# EAGLE board DIP09dat (EAGLE 5.00), part 1 of 2
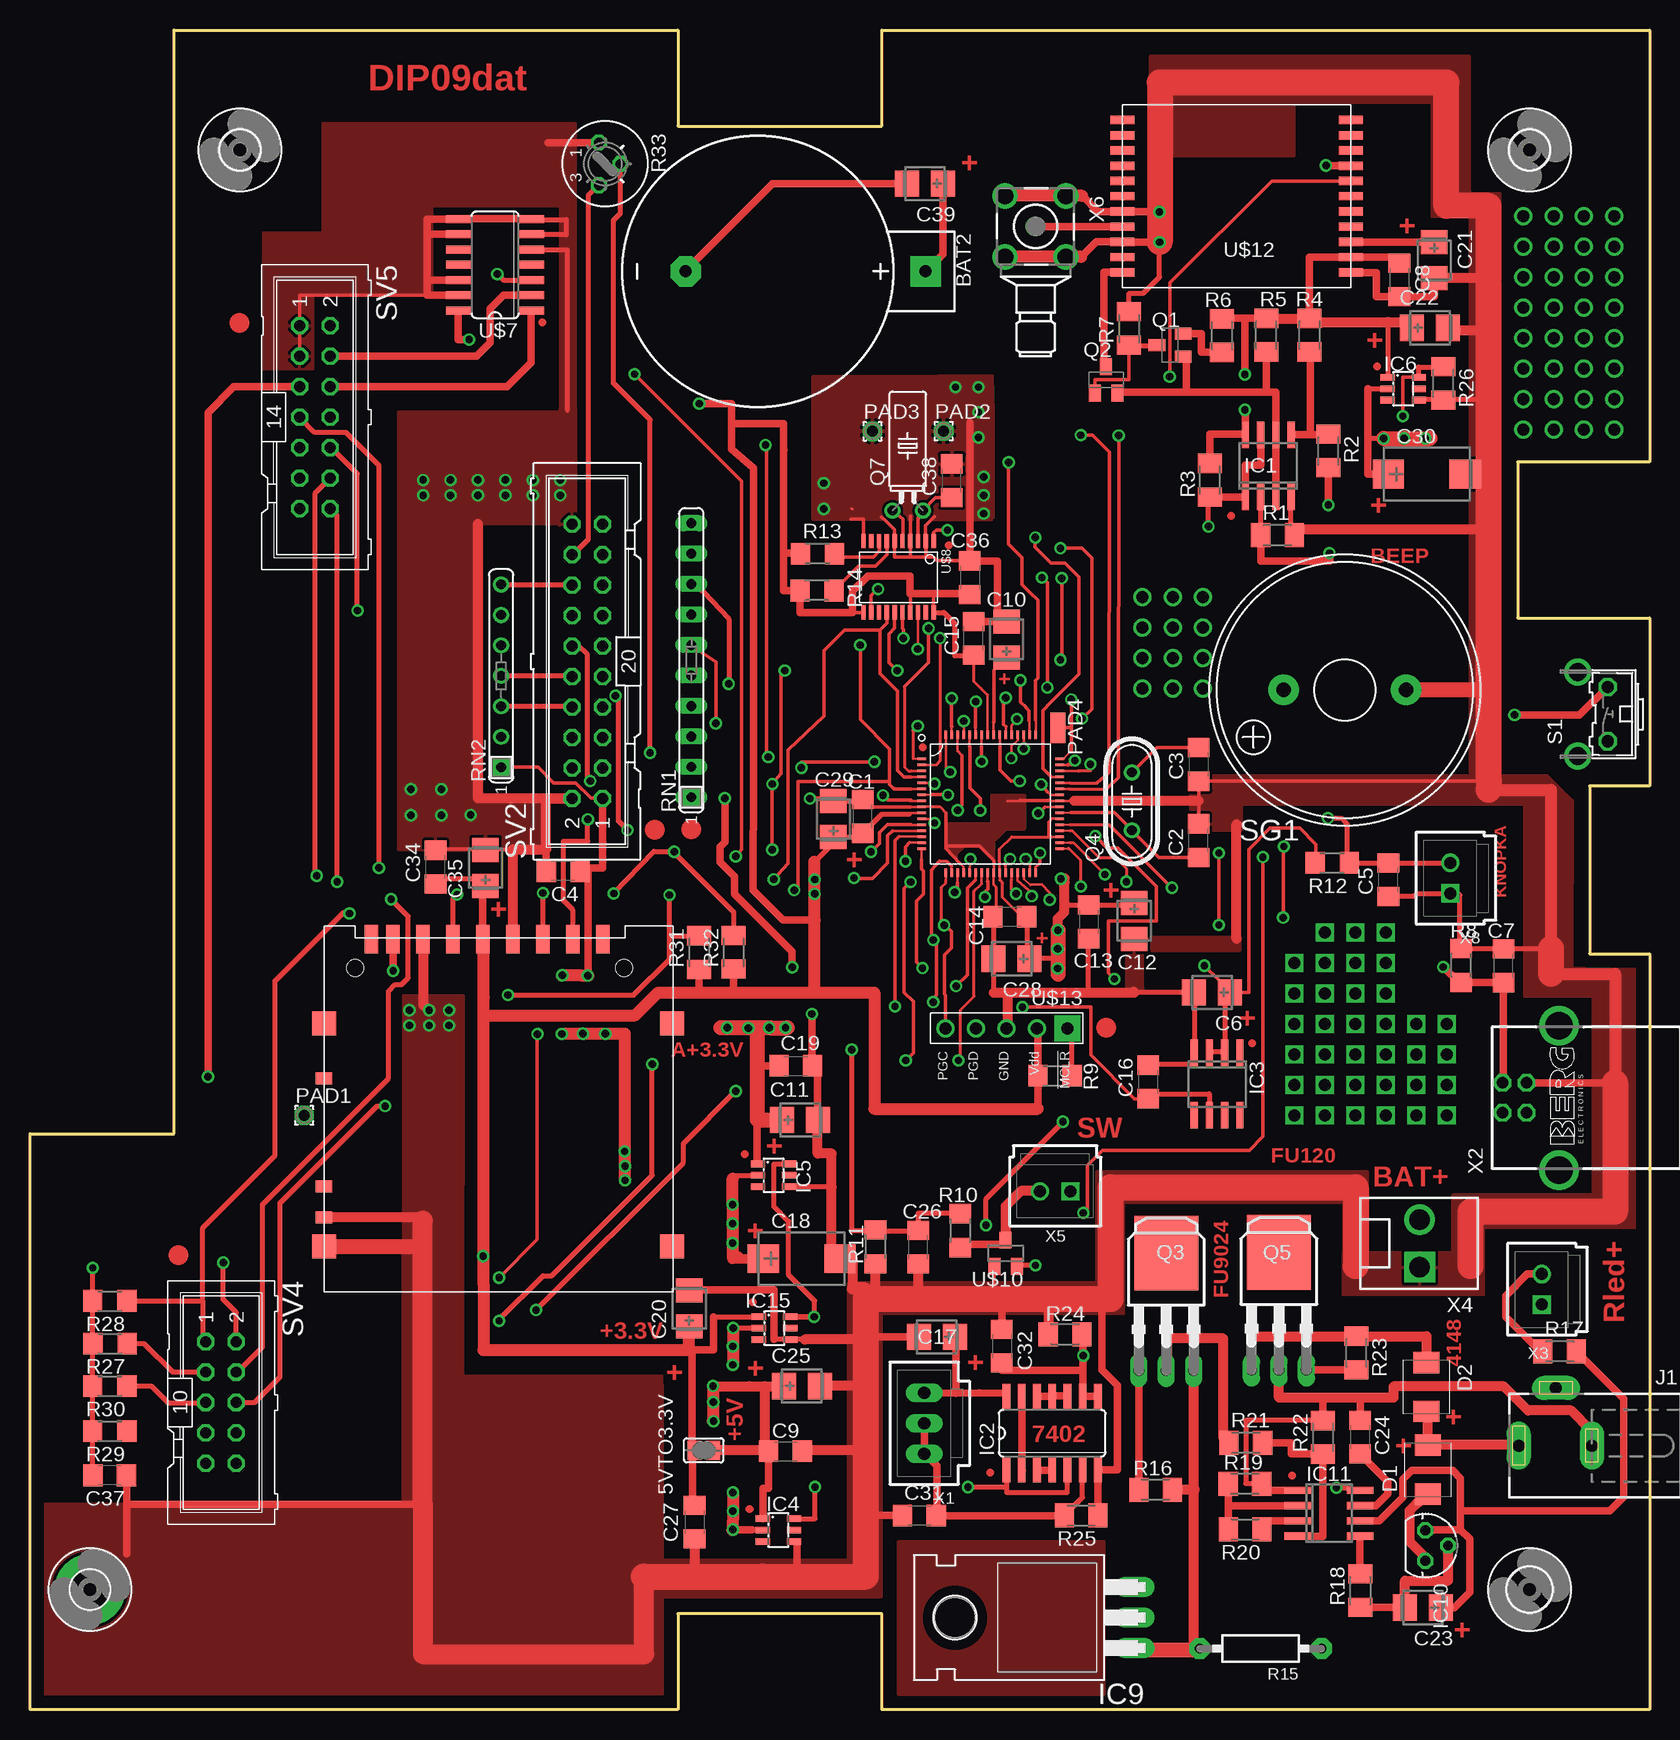
[diagram p2: board, top side]
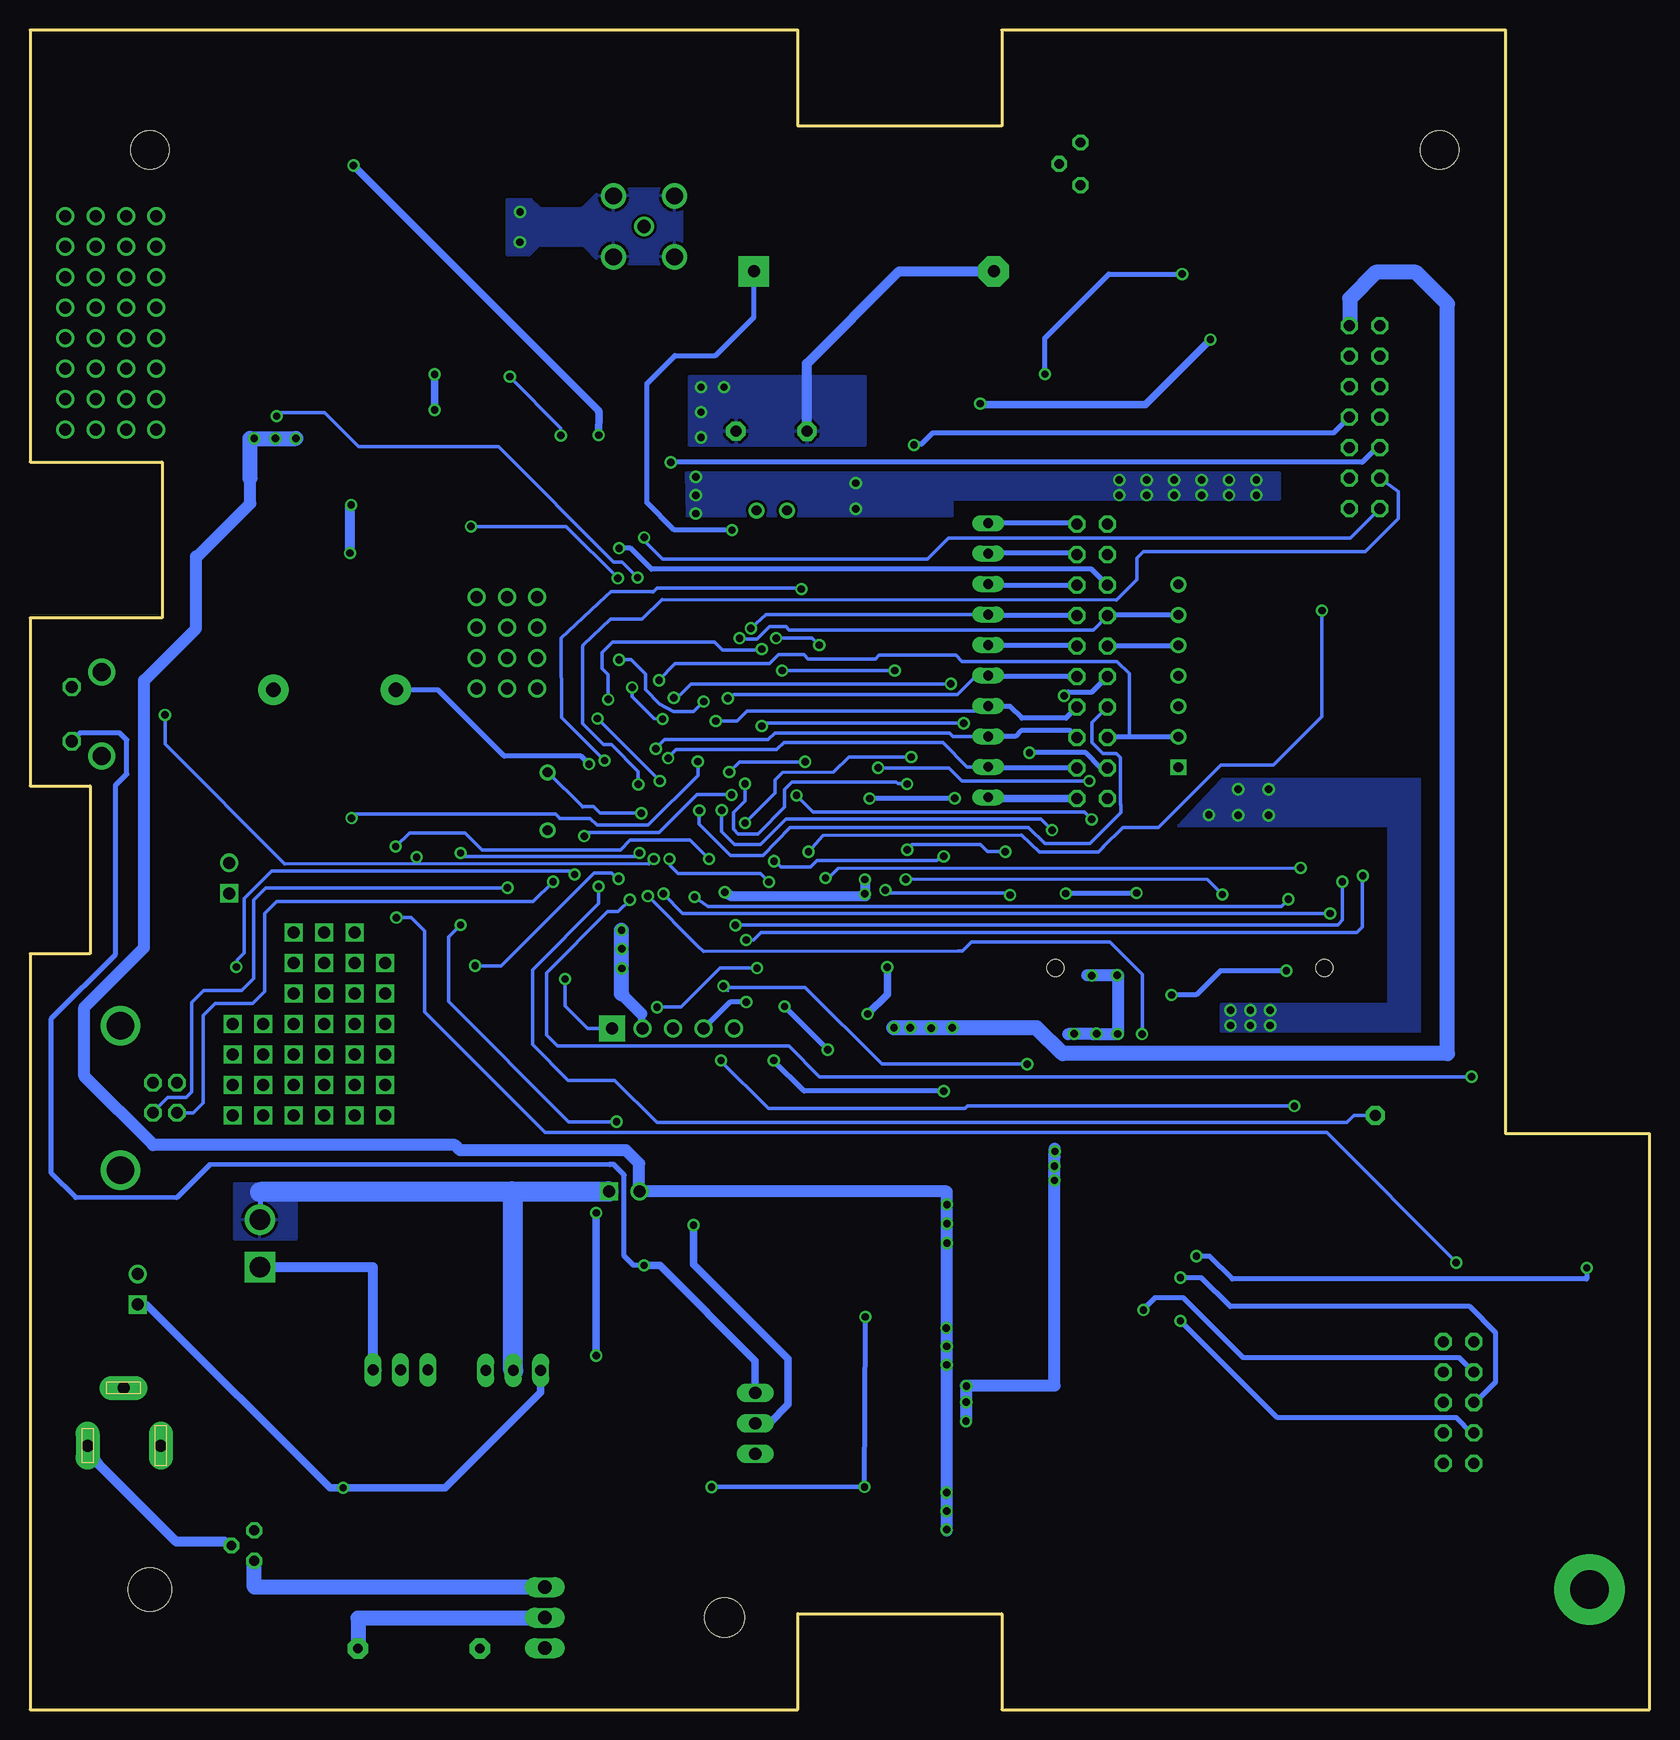
[diagram p3: board, bottom side, seen from below]

Size 135 x 140 mm. Coordinates in mm from the lower left corner, seen from the top.
Outline: 0,0 0,48 12,48 12,140 54,140 54,132 71,132 71,140 135,140 135,104 124,104 124,91 135,91 135,77 130,77 130,63 135,63 135,0 71,0 71,8 54,8 54,0 0,0
Copper layers (1*16): Top 0.035mm / dielectric 1.5mm / Bottom 0.035mm
Design rules "default *": minimum track width 8mil, minimum drill 24mil, track to track 8mil, track to pad 8mil, pad to pad 8mil, via to via 8mil, smd to smd 8mil, copper to edge 40mil, drill to drill 8mil, minimum pad ring 10mil, minimum via ring 8mil, stop-mask expansion 4mil, vias tented up to drill 24mil, thermal gap 10mil
Net classes: 1 power: width 0.813 mm; 2 net12: width 0.305 mm; 3 power25: width 0.635 mm; 4 power24: width 0.61 mm; 5 net16: width 0.406 mm; 6 net8: width 0.203 mm

## Footprints (pad centres in the part's own frame; a part is rotated, then mirrored left to right if it is on the bottom)
SJ = smd 1.168 x 1.6: 1 -0.762,0; 2 0.762,0
SN2032 = drill 1 pad 2.54 square: P$1 0,14 | drill 1 pad 2.54 octagon: P$2 0,-6
C1206 = smd 1.6 x 1.8: 1 -1.4,0; 2 1.4,0
CT3528 = smd 2 x 2.2: + -1.5,0; - 1.5,0
CT7343 = smd 2.6 x 2.4: + -3.2,0; - 3.2,0
SMBJ = smd 1.78 x 2.16: A 2.04,0; C -2.03,0
3,2-PAD = drill 3.2 pad 5.842 round: B3,2 0,0
3,2 = hole 3.2: 0,0
SO08 = smd 0.6 x 2.2: 1 -1.905,-2.6; 2 -0.635,-2.6; 3 0.635,-2.6; 4 1.905,-2.6; 5 1.905,2.6; 6 0.635,2.6; 7 -0.635,2.6; 8 -1.905,2.6
SO14 = smd 0.66 x 2.032: 1 -3.81,-3.073; 2 -2.54,-3.073; 3 -1.27,-3.073; 4 0,-3.073; 5 1.27,-3.073; 6 2.54,-3.073; 7 3.81,-3.073; 8 3.81,3.073; 9 2.54,3.073; 10 1.27,3.073; 11 0,3.073; 12 -1.27,3.073; 13 -2.54,3.073; 14 -3.81,3.073
SOT-23-6 = smd 0.55 x 1.2: 1 -0.95,-1.3; 2 0,-1.3; 3 0.95,-1.3; 4 0.95,1.3; 5 0,1.3; 6 -0.95,1.3
TO220H = drill 1.118 long: 1 -2.54,-10.16; 2 0,-10.16; 3 2.54,-10.16 | hole 3.302: 0,4.826
78LXX = drill 0.813 octagon: GND 0,1.905; IN 1.27,0; OUT -1.27,0
SOIC-8 = smd 0.6 x 2.2: 1 -1.905,-2.6; 2 -0.635,-2.6; 3 0.635,-2.6; 4 1.905,-2.6; 5 1.905,2.6; 6 0.635,2.6; 7 -0.635,2.6; 8 -1.905,2.6
DCJ0303 = drill 1 pad 2 long: 1 0,3.1; 2 4.8,0; 3 0,-3
1,6/0,9 = drill 0.914 pad 1.6 octagon: 1 0,0
SMD1,27-2,54 = smd 1.27 x 2.54: 1 0,0
SOT23-BEC = smd 1 x 1.4: B -0.95,-1.1; C 0,1.1; E 0.95,-1.1
I-PAK_TO251AA = drill 0.889 long: 1 -2.286,-5.334; 2 0,-5.334; 3 2.286,-5.334 | smd 5.334 x 6.223: 4 0,4.445
HC49/S = drill 0.813 round: 1 -2.413,0; 2 2.413,0
TC38H = drill 0.813 round: 1 -1.27,0; 2 1.27,0
M1206 = smd 1.6 x 2: 1 -1.4,0; 2 1.4,0
R1206 = smd 1.6 x 1.803: 1 -1.422,0; 2 1.422,0
0207/10B = drill 0.813 pad 1.676 octagon: 1 -5.08,0; 2 5.08,0
RJ6 = drill 0.813 octagon: A -1.778,-0.508; E 1.778,-0.508; S 0,1.27
SIL10 = drill 0.813 long: 1 -11.43,0; 2 -8.89,0; 3 -6.35,0; 4 -3.81,0; 5 -1.27,0; 6 1.27,0; 7 3.81,0; 8 6.35,0; 9 8.89,0; 10 11.43,0
SIL7 = drill 0.813 square: 1 -7.62,0 | drill 0.813 round: 2 -5.08,0; 3 -2.54,0; 4 0,0; 5 2.54,0; 6 5.08,0; 7 7.62,0
B3F-31XX = drill 1.016 octagon: 1 -2.261,-1.245; 2 2.261,-1.245 | drill 1.499 pad 2.159 round: 3 -3.505,1.245; 4 3.505,1.245
EB2209A = drill 1.2 pad 2.54 round: + 5.093,0; - -5.093,0
ML20 = drill 0.914 octagon: 1 -11.43,-1.27; 2 -11.43,1.27; 3 -8.89,-1.27; 4 -8.89,1.27; 5 -6.35,-1.27; 6 -6.35,1.27; 7 -3.81,-1.27; 8 -3.81,1.27; 9 -1.27,-1.27; 10 -1.27,1.27; 11 1.27,-1.27; 12 1.27,1.27; 13 3.81,-1.27; 14 3.81,1.27; 15 6.35,-1.27; 16 6.35,1.27; 17 8.89,-1.27; 18 8.89,1.27; 19 11.43,-1.27; 20 11.43,1.27
ML10 = drill 0.914 octagon: 1 -5.08,-1.27; 2 -5.08,1.27; 3 -2.54,-1.27; 4 -2.54,1.27; 5 0,-1.27; 6 0,1.27; 7 2.54,-1.27; 8 2.54,1.27; 9 5.08,-1.27; 10 5.08,1.27
ML14 = drill 0.914 octagon: 1 -7.62,-1.27; 2 -7.62,1.27; 3 -5.08,-1.27; 4 -5.08,1.27; 5 -2.54,-1.27; 6 -2.54,1.27; 7 0,-1.27; 8 0,1.27; 9 2.54,-1.27; 10 2.54,1.27; 11 5.08,-1.27; 12 5.08,1.27; 13 7.62,-1.27; 14 7.62,1.27
3,6 = hole 3.6: 0,0
TQFP-64-PT-0.5MM = smd 0.7 x 0.22: 1 -5.75,3.75; 2 -5.75,3.25; 3 -5.75,2.75; 4 -5.75,2.25; 5 -5.75,1.75; 6 -5.75,1.25; 7 -5.75,0.75; 8 -5.75,0.25; 9 -5.75,-0.25; 10 -5.75,-0.75; 11 -5.75,-1.25; 12 -5.75,-1.75; 13 -5.75,-2.25; 14 -5.75,-2.75; 15 -5.75,-3.25; 16 -5.75,-3.75; 33 5.75,-3.75; 34 5.75,-3.25; 35 5.75,-2.75; 36 5.75,-2.25; 37 5.75,-1.75; 38 5.75,-1.25; 39 5.75,-0.75; 40 5.75,-0.25; 41 5.75,0.25; 42 5.75,0.75; 43 5.75,1.25; 44 5.75,1.75; 45 5.75,2.25; 46 5.75,2.75; 47 5.75,3.25; 48 5.75,3.75 | smd 0.22 x 0.7: 17 -3.75,-5.75; 18 -3.25,-5.75; 19 -2.75,-5.75; 20 -2.25,-5.75; 21 -1.75,-5.75; 22 -1.25,-5.75; 23 -0.75,-5.75; 24 -0.25,-5.75; 25 0.25,-5.75; 26 0.75,-5.75; 27 1.25,-5.75; 28 1.75,-5.75; 29 2.25,-5.75; 30 2.75,-5.75; 31 3.25,-5.75; 32 3.75,-5.75; 49 3.75,5.75; 50 3.25,5.75; 51 2.75,5.75; 52 2.25,5.75; 53 1.75,5.75; 54 1.25,5.75; 55 0.75,5.75; 56 0.25,5.75; 57 -0.25,5.75; 58 -0.75,5.75; 59 -1.25,5.75; 60 -1.75,5.75; 61 -2.25,5.75; 62 -2.75,5.75; 63 -3.25,5.75; 64 -3.75,5.75
TSSOP_20 = smd 0.36 x 1.19: 1 0,0; 2 0.65,0; 3 1.3,0; 4 1.95,0; 5 2.6,0; 6 3.25,0; 7 3.9,0; 8 4.55,0; 9 5.2,0; 10 5.85,0; 11 5.85,5.94; 12 5.2,5.94; 13 4.55,5.94; 14 3.9,5.94; 15 3.25,5.94; 16 2.6,5.94; 17 1.95,5.94; 18 1.3,5.94; 19 0.65,5.94; 20 0,5.94
SOT-23 = smd 1 x 1.4: 1 -0.95,-1.1; 2 0.95,-1.1; 3 0,1.1
DM1A = smd 1.1 x 2.4: 1 18.15,2.4; 2 15.65,2.4; 3 13.15,2.4; 4 10.65,2.4; 5 8.15,2.4; 6 5.65,2.4; 7 3.15,2.4; 8 1.35,2.4; 9 20.65,2.4 | smd 1.4 x 1: P14CD -2.6,-9.2; P15WP -2.6,-18.2; P16COM -2.6,-20.8 | smd 2 x 2: P$10 26.4,-4.6; P$11 26.4,-23.2; P$12 -2.6,-4.6; P$13 -2.6,-23.2 | hole 1.4: 0,0; 22.4,0
A1080 = smd 2 x 0.7: 1 0,0; 2 0,-1.27; 3 0,-2.54; 4 0,-3.81; 5 0,-5.08; 6 0,-6.35; 7 0,-7.62; 8 0,-8.89; 9 0,-10.16; 10 0,-11.43; 11 0,-12.7; 12 19.05,-12.7; 13 19.05,-11.43; 14 19.05,-10.16; 15 19.05,-8.89; 16 19.05,-7.62; 17 19.05,-6.35; 18 19.05,-5.08; 19 19.05,-3.81; 20 19.05,-2.54; 21 19.05,-1.27; 22 19.05,0
PIC-PROG-CON = drill 1 pad 2.184 square: 1 -3.81,0 | drill 1 round: 2 -1.27,0; 3 1.27,0; 4 3.81,0; 5 6.35,0
70543-03 = drill 1.016 long: 1 -2.54,0; 2 0,0; 3 2.54,0
PN61729-S = drill 0.95 octagon: 1 1.25,4.71; 2 -1.25,4.71; 3 -1.25,2.71; 4 1.25,2.71 | drill 2.3 pad 2.9 round: S1 -6.02,0; S2 6.02,0
70543-02 = drill 1.016 square: 1 -1.27,0 | drill 1.016 round: 2 1.27,0
KK-156-2 = drill 1.7 pad 2.184 square: 1 -1.98,0 | drill 1.7 pad 2.184 round: 2 1.98,0
BU-SMB-H = drill 1.1 round: 1 0,0 | drill 1.4 round: 2 -2.54,2.54; 3 2.54,2.54; 4 2.54,-2.54; 5 -2.54,-2.54

## Placement (x,y rotation side)
5VTO3.3V  5VTO3.3V  [SJ]  56.16,21.61 0 top
BAT2  VCLOCK  [SN2032]  60.66,119.88 270 top
C1  0.47uF  [C1206]  69.42,74.45 90 top
C2  15pF  [C1206]  97.4,72.43 90 top
C3  15pF  [C1206]  97.43,78.78 90 top
C4  1uF  [C1206]  44.45,69.89 180 top
C5  1uF  [C1206]  113.23,69.17 90 top
C6  10u  [CT3528]  98.53,59.77 180 top
C7  2uF  [C1206]  122.83,61.98 90 top
C8  0.47u  [C1206]  114.14,119.17 270 top
C9  0.47u  [C1206]  62.97,21.53 0 top
C10  10u  [CT3528]  81.41,89.2 90 top
C11  10u  [CT3528]  64.2,49.15 0 top
C12  10u  [CT3528]  92.05,65.75 270 top
C13  0.47uF  [C1206]  88.25,65.65 270 top
C14  0.47uF  [C1206]  81.68,66.07 180 top
C15  0.47uF  [C1206]  78.65,89.29 90 top
C16  1.0u  [C1206]  93.22,52.31 90 top
C17  10u  [CT3528]  75.59,31.06 180 top
C18  100u  [CT7343]  64.32,37.59 0 top
C19  0.47u  [C1206]  63.83,53.66 0 top
C20  10u  [CT3528]  54.95,33.42 90 top
C21  47u  [CT3528]  117.06,120.82 270 top
C22  47u  [CT3528]  116.7,115.17 0 top
C23  47u  [CT3528]  116.1,8.5 180 top
C24  2n2  [C1206]  110.86,22.71 270 top
C25  47u  [CT3528]  64.34,26.97 0 top
C26  0.47uF  [C1206]  74.04,38.54 90 top
C27  0.47u  [C1206]  55.39,15.62 270 top
C28  10u  [CT3528]  81.83,62.58 180 top
C29  10u  [CT3528]  66.97,74.23 90 top
C30  100u  [CT7343]  116.43,102.98 0 top
C31  1u  [C1206]  74.14,16.18 0 top
C32  1u  [C1206]  81.01,30.29 270 top
C34  0.47u  [C1206]  33.81,70.22 90 top
C35  10u  [CT3528]  37.97,70.15 90 top
C36  0.47uF  [C1206]  78.34,94.35 270 top
C37  0.47uF  [C1206]  6.65,19.52 180 top
C38  15p  [C1206]  76.83,102.43 90 top
C39  10u  [CT3528]  74.61,127.19 180 top
D1  15MQ040  [SMBJ]  116.51,19.99 90 top
D2  1N4148  [SMBJ]  116.4,26.9 270 top
H1  MOUNT-PAD-ROUND3.2  [3,2-PAD]  5,10 0 top
H2  MOUNT-HOLE3.2  [3,2]  125,130 0 top
H3  MOUNT-HOLE3.2  [3,2]  17.5,130 0 top
IC1  MCP6547  [SO08]  103.22,103.67 0 top
IC2  74AC02D  [SO14]  85.21,23.04 0 top
IC3  REF191  [SO08]  98.95,52.14 180 top
IC4  ADP3330_5  [SOT-23-6]  62.39,14.96 270 top
IC5  ADP3330_3  [SOT-23-6]  61.99,44.53 270 top
IC6  ADP3330  [SOT-23-6]  114.47,110.09 270 top
IC9  317T  [TO220H]  81.94,7.66 90 top
IC10  78L09  [78LXX]  116.3,13.66 270 top
IC11  TEA1104  [SOIC-8]  108.28,16.36 270 top
IC15  ADP3330_3  [SOT-23-6]  62.06,31.79 270 top
J1  DJK-02A  [DCJ0303]  127.2,22 90 top
PAD1  p_pad  [1,6/0,9]  22.86,49.53 0 top
PAD2  GND  [1,6/0,9]  76.16,106.56 0 top
PAD3  GND  [1,6/0,9]  70.22,106.55 0 top
PAD4  32768  [SMD1,27-2,54]  85.68,81.85 180 top
Q1  BC858ASMD  [SOT23-BEC]  95.03,113.72 90 top
Q2  BC858ASMD  [SOT23-BEC]  89.7,110.83 0 top
Q3  IRFU9024  [I-PAK_TO251AA]  94.72,33.6 0 top
Q4  20MHz  [HC49/S]  91.85,75.7 90 top
Q5  IRFU120  [I-PAK_TO251AA]  104.11,33.65 0 top
Q7  32768  [TC38H]  73.17,99.95 0 top
R1  63.4k  [M1206]  103.98,97.88 0 top
R2  2.2k  [M1206]  108.23,104.91 270 top
R3  100k  [M1206]  98.34,102.47 270 top
R4  2.2k  [M1206]  106.67,114.57 270 top
R5  10E  [M1206]  103.04,114.56 270 top
R6  100E  [M1206]  99.37,114.52 270 top
R7  10k  [M1206]  91.61,115.12 90 top
R8  150K  [R1206]  119.3,62.02 270 top
R9  10K  [R1206]  85.45,52.82 180 top
R10  1M1  [R1206]  77.54,39.92 90 top
R11  470K  [R1206]  70.48,38.56 270 top
R12  10K  [R1206]  108.55,70.58 180 top
R13  10K  [R1206]  65.65,96.34 0 top
R14  10K  [R1206]  65.61,93.27 0 top
R15  5.1E  [0207/10B]  102.58,5.08 180 top
R16  10k  [M1206]  93.83,18.33 0 top
R17  5.1k  [M1206]  127.51,29.84 0 top
R18  27k  [M1206]  110.88,9.91 90 top
R19  5.1k  [M1206]  101.27,18.82 0 top
R20  13k  [M1206]  101.29,15.02 180 top
R21  10k  [M1206]  101.35,22.23 0 top
R22  4.3k  [M1206]  107.78,22.69 90 top
R23  10k  [M1206]  110.57,29.72 270 top
R24  1k  [M1206]  86.28,31.29 180 top
R25  1k  [M1206]  87.63,16.17 180 top
R26  10k  [M1206]  117.81,110.54 270 top
R27  10K  [R1206]  6.67,30.52 180 top
R28  10K  [R1206]  6.66,34.06 180 top
R29  10K  [R1206]  6.66,23.21 180 top
R30  10K  [R1206]  6.66,26.96 180 top
R31  10k  [M1206]  55.78,63.09 90 top
R32  10k  [M1206]  58.66,63.12 90 top
R33  10k  [RJ6]  47.94,128.84 270 top
RN1  10k  [SIL10]  55.13,87.46 90 top
RN2  10k  [SIL7]  39.27,86.16 90 top
S1  SWT-7  [B3F-31XX]  130.27,82.98 90 top
SG1  EB2209A  [EB2209A]  109.6,84.99 180 top
SV2  T6963 DYSPLAY  [ML20]  46.44,87.38 90 top
SV4  KLAVA  [ML10]  15.93,25.59 270 top
SV5  TO_ANALOG  [ML14]  23.75,107.72 270 top
U$5  [3,6]  125,10 0 top
U$6  PIC24FJZZZGB106  [TQFP-64-PT-0.5MM]  80.08,75.5 0 top
U$7  HEF4070B  [SO14]  38.77,120.42 90 top
U$8  DS1306_TSSOP_PAK  [TSSOP_20]  75.33,97.39 180 top
U$10  MCP1702  [SOT-23]  81.33,38.03 0 top
U$11  HRS_DM1A  [DM1A]  27.11,61.8 0 top
U$12  TYCO_A1080  [A1080]  110.12,119.79 180 top
U$13  PIC-PROG-CON  [PIC-PROG-CON]  82.67,56.78 180 top
X1  C-GRID-03-70543  [70543-03]  74.54,23.86 90 top
X2  PN61729-S  [PN61729-S]  127.47,50.98 90 top
X3  C-GRID-02-70543  [70543-02]  126.02,35.03 90 top
X4  ACCUM  [KK-156-2]  115.85,38.85 90 top
X5  C-GRID-02-70543  [70543-02]  85.46,43.18 180 top
X6  GPS  [BU-SMB-H]  83.82,123.63 270 top
X8  C-GRID-02-70543  [70543-02]  118.39,69.3 90 top

## Tracks (layer width: path | path; a pad name or v marks a point on that pad's centre or on a via)
32KHZ  (via drill 0.61)
  Top 0.203: 86.8,80 86.15,79.25 U$6.48 | v74,88.4 74,90.9 U$8.18
  Top 0.305: v86.8,84.2 86.8,81.86 | 86.8,81.86 86.8,80 | 86.8,81.86 86.78,81.86 86.78,81.85 PAD4.1
  Bottom 0.305: v86.8,84.2 86.8,86.26 87.3,86.76 87.3,88.11 86.42,88.99 77.93,88.99 77.27,88.33 74.04,88.33 73.98,88.39 73.99,88.4 v74,88.4
+3V3  (via drill 0.61)
  Top 0.203: v37.76,37.79 37.8,35.5 | 79.3,85.1 79.83,84.6 79.83,84.57 79.83,81.5 U$6.57 | 98.6,54.8 IC3.3 | 99.3,54.8 IC3.2 99.6,55.8 | C6.+ 99.6,58.7 | 84.93,74 85.18,74.25 85.51,74.25 U$6.38 | 85.14,72.74 U$6.35 | 77.33,68.93 U$6.19 | 86.27,67.07 86.21,67.18 86.1,67.4 | 80.84,69.16 U$6.26 80.83,70.64 | v65.41,69.19 65.41,68 v65.4,68 v65.41,67.99 | 65.41,65.8 65,65.8 | U$6.10 74,74.75 73.3,74.74 73.31,74.64 | v85.67,61.77 85.7,61.8 85.69,61.8 | v85.67,63.41 85.7,63.4 85.69,63.4 | R9.2 84.1,52.9 84.02,52.9
  Top 0.254: 84.93,72.74 85.14,72.74 | 84.93,72.74 84.93,74 | 80.83,70.64 80.83,71.74 81.84,72.74 84.93,72.74 | 80.84,69.16 80.84,69.12 81.08,68.89 81.08,67.68 82.37,66.39 82.7,66.39 83.02,66.07 C14.1 | 79.83,84.57 79.81,84.57 78.65,85.73 78.65,87.85
  Top 0.305: v97.9,62 99.1,60.8 C6.+ 100.02,59.75 | U$8.17 73.38,93.1 73.36,93.1 | U$8.20 75.33,93.03 75.34,93.03 | 100.02,59.75 99.82,59.75 | 100.02,59.75 101.61,59.75 101.61,71.7 103.37,73.46 105.84,73.46 107.2,72.1 107.2,70.5 R12.2 | 77.33,68.93 | 77.33,68.93 77.33,68.95 | v77.08,68.12 77.33,68.37 77.33,68.93 | U$8.11 68.59,91.45 68.58,91.44
  Top 0.406: IC15.1 56.96,32.73 | 83.13,62.58 83.13,66.07 | C13.1 91.94,67.05 | C29.+ 69.03,72.73 | 99.3,54.8 98.6,54.8 | 99.6,58.7 99.6,55.8 | 37.97,69.23 33.81,69.23 | 36.63,114.19 36.6,114.19 v36.6,114.2 | 58.47,107.19 61.01,107.14 | C37.2 5.25,23.16 5.23,23.18 5.24,23.2 R29.2 R30.2 | R30.2 5.24,26.98 5.23,26.99 | R30.2 5.24,30.3 5.27,30.33 5.25,30.36 R27.2 5.25,33.89 5.27,33.91 5.24,33.94 R28.2 v5.23,36.81 v5.24,36.81 | C1.1 71.02,74.64 73.31,74.64 | 86.23,67.2 86.22,67.2 86.21,67.18 | 86.23,68.94 v85.93,69.25 | 85.71,62.6 83.33,62.6 | 86.28,67.06 C13.1 | U$8.20 76.17,91.45 77.07,90.55 77.07,87.85 78.65,87.85 | 78.65,87.85 78.68,87.85 | 78.65,87.85 C15.1 | 65.39,70.65 66.97,72.23
  Top 0.61: 56.96,32.73 56.96,29.97 55.24,29.97 | 55.23,21.61 55.23,17.02 | 65,65.8 62.78,65.8 60.28,68.3 60.32,78.25 60.33,78.85 60.33,103.47 58.47,105.05 58.47,107.19 | 58.47,107.19 58.47,108.85 v55.79,108.85 | 58.47,107.19 62.8,107.19 62.8,104.92 | C36.2 78.34,93.03 75.34,93.03 73.36,93.03 73.36,93.1 73.36,94.47 73.34,94.36 73.28,94.49 69.85,94.49 68.58,93.22 68.58,91.44 64.19,91.44 R14.1 62.8,93.27 62.8,96.39 | 37.74,68.65 37.74,68.68 | 37.74,68.65 C35.+ 37.97,69.23 | 37.8,64.26 37.74,64.26 37.74,68.65 | 33.8,69.23 33.81,69.23 C34.1 | U$7.14 35.7,114.19 36.6,114.19 | 84.02,50.08 84.02,52.9 84.02,56.73 | 62.8,104.92 62.8,96.39 | 62.8,104.92 62.86,104.98 | 54.93,29.97 54.99,29.97 | 54.99,29.97 55.24,29.97 | 54.99,29.97 54.99,29.96 | 55.24,29.97 55.19,29.97 55.19,21.61 | R13.1 64.18,96.39 62.8,96.39 | 58.69,59.76 58.69,59.8 58.66,59.83 R32.1 | 55.82,59.76 55.82,59.82 55.78,59.85 R31.1
  Top 0.813: 55.19,21.61 5VTO3.3V.1 55.23,21.61 | 55.23,17.02 C27.1 | 83.13,66.09 83.13,66.07 C14.1 | C28.+ 83.13,62.58 | 88.18,67.07 88.2,67.05 C13.1 | C12.+ 92.05,67.24 92.09,67.2 91.94,67.05 | C1.1 69.37,73.05 69.36,73.06 69.03,72.73 | 86.23,67.2 86.23,68.94 86.23,69.28 85.91,69.28 | 86.28,67.06 86.27,67.07 86.21,67.02 86.21,66.47 85.68,65.93 85.68,64.95 v85.69,64.97
  Top 1.016: 37.8,57.86 37.8,35.5 37.8,29.97 54.93,29.97 54.93,31.92 C20.+ | 37.8,57.86 37.8,59.38 | 37.8,59.38 37.8,59.77 37.8,64.2 | 65.41,68 65.41,65.8 65.41,59.99 65.3,59.99 65.49,59.81 | 37.8,64.2 37.8,64.26 | 37.8,64.2 U$11.4 | 65.49,59.81 65.54,59.76 | 84.02,56.71 83.96,56.78 U$13.2 83.94,56.73 84.02,56.73 | 37.8,59.38 37.83,59.38 | 65.55,59.77 | 65.54,59.76 65.55,59.77 | 65.54,59.76 70.38,59.76 70.38,50.08 84.02,50.08 | 65.49,59.81 65.51,59.83 | 65.49,59.81 | 65.49,59.81 65.44,59.76 58.69,59.76 55.82,59.76 52.36,59.76 50.46,57.86 37.8,57.86 | 66.97,72.23 C29.+ | 65.41,67.92 65.42,67.91 | v65.41,67.99 65.41,67.92 | 65.39,70.65 65.39,67.93 65.41,67.92
  Top 1.27: v85.69,64.97 85.69,63.4 85.69,61.8 85.69,61.3 85.71,61.3 85.71,62.6 | 83.33,62.6 C28.+
  Bottom 0.203: U$13.2 83.9,56.8 84.02,56.8
  Bottom 0.305: v97.9,62 95.71,62 87.97,69.74 86.51,69.74 86.01,69.25 v85.93,69.25
  Bottom 0.406: 55.77,108.78 55.77,108.84 v55.79,108.85 | v37.77,37.79 37.78,37.79 | v37.77,37.79 v37.76,37.79 | v37.77,37.79 36.68,37.79 34.77,35.88 5.23,35.88 v5.23,36.81 v5.24,36.81 | 76.64,67.87 76.66,67.89 76.69,67.89 | v85.93,69.25 85.95,69.26
  Bottom 0.61: v36.6,114.2 42.02,108.78 55.77,108.78 | 84.02,57.99 84.02,56.8 84.02,56.71
  Bottom 0.813: 76.64,67.87 76.55,67.78 65.34,67.78 65.38,67.82 65.38,69.21 | 65.38,69.21 65.38,69.27 | v65.41,69.19 65.38,69.21 | 77.09,68.14 | 77.09,68.14 v77.08,68.12 | 76.69,67.89 76.94,68.14 77.09,68.14
  Bottom 1.016: 84.02,57.99 85.69,59.65
  Bottom 1.27: 85.69,59.65 v85.69,64.97
+5V  (via drill 0.61)
  Top 0.203: v44.38,61.2 44.4,61.2 44.32,61.2 | 46,61.18 46,61.2 v46.49,61.17 | 44.33,56.33 44.4,56.4 44.27,56.32 | v46.1,56.33 46.1,56.4 46.1,56.32 | v47.96,56.32 48,56.4 48,56.32 | v44.34,56.31 44.4,56.3 44.4,56.32 | 46.53,69.3 46.6,69.3 C4.1
  Top 0.305: RN2.1 42.34,78.54 43.64,77.24 45.48,77.24 46.76,75.97 47.68,75.97 SV2.1
  Top 0.406: C25.+ 62.81,26.97 62.8,26.96
  Top 0.61: 46.53,61.18 46.53,69.3 46.53,70.04 | IC4.1 61.09,18.45 61.58,18.45 61.58,21.44 61.57,21.44 | 61.57,21.44 61.54,21.44 | C9.1 61.57,21.44 | C4.1 45.82,70.14 47.71,70.14 SV2.1 | 59.96,26.96 59.96,26.94
  Top 0.813: 61.59,21.61 61.59,21.53 C9.1 | 61.24,21.62 5VTO3.3V.2 | 61.24,21.62 61.59,21.61 | 61.59,21.61 61.59,21.71 | 56.93,26.96 59.96,26.96 62.8,26.96 | 61.24,21.62 61.24,26.95 59.96,26.94
  Top 1.016: 56.93,26.96 v56.93,26.97 56.93,24.08 56.98,24.08 v56.98,24.03 | v49.6,44.1 v49.6,45.29 49.6,56.32 48,56.32 46.1,56.32 44.4,56.32 44.27,56.32 | 46.53,61.18 46,61.18 44.32,61.18 44.32,61.2 44.32,61.21
  Bottom 0.203: v46.49,61.17 46.5,61.2 46.5,61.21 | 46.4,56.31 46.4,56.3 v46.1,56.33 | v44.34,56.31 44.7,56.3 44.27,56.32 | 49.6,46.1 v49.56,46.52
  Bottom 0.61: 55.17,76.03 55.17,76.04 | 55.17,76.03 RN1.1 | SV2.1 55.17,75.95 55.17,76.03
  Bottom 1.016: v56.98,24.03 56.98,24.05 56.96,24.05 v56.96,25.63 | v56.93,26.97 56.93,25.62 56.98,25.62 56.98,26.98 49.6,26.98 v49.6,44.1 | v49.6,44.1 | v49.6,44.1 49.6,46.1 | 49.6,46.1 | 49.6,46.1 49.6,46.74 | 44.3,56.31 46.4,56.31 48.45,56.31 | 44.27,56.32 44.27,61.21 46.5,61.21 46.86,61.21
+7V  (via drill 0.61)
  Top 0.203: 60.2,31.8 IC15.2 | v58.56,38.88 58.6,38.9 58.58,38.9 | 58.58,41 58.6,41 v58.56,40.5 | v58.56,42.09 58.6,42.1 58.58,42.1 | v58.59,16.55 58.6,16.6 | 58.59,31.8 58.7,31.8 | v58.58,30.26 58.6,30.3 58.59,30.3 | v114.55,105.97 114.6,106 114.6,105.95 | 59,37.7 58.58,37.71 58.6,37.6 58.55,37.6
  Top 0.406: 60.2,14.97 IC4.2 | IC5.2 58.58,44.53 58.58,44.26 | 58.59,28.7 v58.59,28.73 v58.58,28.73 | 58.59,31.8 v58.61,31.8 58.7,31.8 60.2,31.8 | v58.6,18.1 v58.6,18.09 v58.59,18.09 | v112.85,105.95 111.46,105.95 111.46,106.05 | 111.46,106.05 111.46,110.08 111.53,110.08 IC6.2 | IC6.2 | IC6.2 113.16,110.06 | 111.46,106.05 111.47,106.05 111.47,102.87
  Top 0.61: 58.55,14.97 60.2,14.97 | U$10.3 81.33,38.79 77.83,38.79 R10.1 | 111.53,110.09 111.53,110.08 111.53,102.98 C30.+
  Top 0.813: 84.19,43.21 84.21,43.21 | X5.2 84.19,43.21 | 84.19,43.21 82.6,43.21 81.33,41.94 U$10.3 81.33,39.12 81.34,39.12 | C18.+ 58.55,37.56 58.55,37.6 58.55,37.67
  Top 1.016: 58.58,37.71 58.58,38.9 58.58,41 58.58,42.1 58.58,44.26 | v58.59,28.73 58.59,30.3 58.59,31.8 | 58.55,14.97 58.6,16.6 v58.6,18.09 | 59,37.7 58.6,37.7
  Top 1.27: v112.85,105.95 114.6,105.95 116.67,105.95 116.7,105.97
  Bottom 0.203: v58.59,15 v58.58,14.99 | 58.58,31.8 v58.61,31.8 | X5.2 84.6,44.6 | v58.59,18.09 v58.6,18.1 v58.58,18.1 | v58.56,42.09 58.6,42.1 58.58,42.1 | 116.66,105.5 116.5,105.5 v116.31,105.97
  Bottom 1.016: 58.58,14.92 v58.58,14.99 v58.58,18.1 58.58,31.8 58.58,42.1 58.58,43.18 X5.2 84.16,43.18 84.07,43.27 84.22,43.43 84.22,45.52 85.33,46.62 99.13,46.62 99.57,47.06 124.75,47.06 130.47,52.79 130.47,52.8 130.47,58.52 125.48,63.51 125.48,85.78 121.15,90.11 121.15,96.13 121.14,96.14 121.03,96.14 116.64,100.53 116.64,102.62 116.67,102.66 116.66,102.66
  Bottom 1.27: v112.85,105.95 116.66,105.95 116.66,105.5 116.66,102.66 116.66,102.62
ADC_0  (via drill 0.61)
  Top 0.203: 83.4,68.75 82.84,69.25 82.84,69.4 U$6.30
  Top 0.254: v85,67.5 85,68.06 84.36,68.75 83.4,68.75
  Top 0.305: 22.52,110.28 22.5,110.26 SV5.5
  Top 0.61: v14.83,52.74 14.83,108.12 16.99,110.28 22.52,110.28
  Bottom 0.305: v85,67.5 85.99,66.51 86.84,66.51 91.94,61.41 91.94,56.22 91.01,55.3 71.74,55.3 69.18,52.74 v14.83,52.74 | 22.53,110.24 22.5,110.24 SV5.5
ADC_1  (via drill 0.61)
  Top 0.203: 71.93,73.24 74,73.25 U$6.13
  Top 0.305: 71.93,73.24 71.89,73.24 71.48,72.83 71.48,70.56 70.22,69.29 68.67,69.29 | 68.67,69.29 68.66,69.29 | v68.69,69.31 68.67,69.29
  Top 0.406: SV5.7 23.74,106.46 26.35,106.46 29.1,103.7 29.1,70.17 | 29.1,70.17 29.08,70.17 v29.08,70.16 | 29.1,70.17 29.11,70.17
  Bottom 0.305: v29.08,70.16 67.63,70.1 68.43,69.3 v68.69,69.3 v68.69,69.31
AN_3.3V  (via drill 0.61)
  Top 0.203: v58.12,56.83 58.2,56.9 58.2,56.82 | 60.62,56.3 60,56.3 v59.87,56.8 | v61.62,56.83 61.7,56.9 61.7,56.82
  Top 0.61: 60.62,53.63 60.58,53.63 60.58,53.66 C19.1 | IC5.1 60.69,45.5 60.62,45.5 60.62,49.16
  Top 0.813: C19.1
  Top 1.27: 60.59,56.82 60.62,56.85 60.62,56.3 60.62,53.63 60.62,49.16 C11.+ | 60.59,56.82 58.2,56.82 57.6,56.82 | 60.59,56.82 61.7,56.82 63.12,56.82 63.12,56.85
  Bottom 0.203: v61.62,56.83 61.7,56.9 61.7,56.83
  Bottom 1.27: v62.98,56.83 61.7,56.83 v61.62,56.83 51.09,56.83 48.92,54.67 16.85,54.67 16.85,117.17 19.48,119.8 22.82,119.8 24.99,117.62 24.99,115.35 25.01,115.34 SV5.2
ANTSTAT  (via drill 0.61)
  Top 0.203: v85.9,87.5 86,87.6 | U$6.59 78.83,81.87
  Top 0.305: 86,87.6 v86,94.3 | 78.83,81.87 78.83,84.02 v78.84,84.02
  Top 0.406: R3.2 98.34,101.09 98.24,101.09 v98.24,98.62
  Top 0.61: IC1.1 101.33,101.07 | IC1.1 | R3.2 IC1.1 | IC1.1 101.31,103.72 102.58,103.72 102.58,106.2 | 102.58,106.2 IC1.7 | 102.58,106.2 102.6,106.2
  Bottom 0.305: v86,94.3 90.3,98.6 96.9,98.6 v98.24,98.62 | v78.84,84.02 79.68,83.19 81.36,83.19 82.52,83.83 83.7,85.01 83.7,86.31 84.89,87.5 v85.9,87.5
BATT_ZAMER  (via drill 0.61)
  Top 0.203: 72.42,72.75 74,72.75 U$6.14
  Top 0.305: v72.1,58.6 72.1,72.43 72.42,72.75
  Top 0.406: 70.48,39.94 70.6,39.94 | 70.48,39.94 R11.1 70.48,39.89 74.04,39.89 C26.2 74.04,41.38 77.54,41.38 R10.2 | v68.5,55 68.5,39.94 70.48,39.94
  Bottom 0.406: v68.5,55 v72.1,58.6
BEEP  (via drill 0.61)
  Top 0.203: U$6.46 87.4,78.24
  Top 0.305: v88.4,78.8 v88.39,78.8 88.39,78.26 87.4,78.24
  Bottom 0.406: v88.4,78.8 89.08,79.48 95.48,79.48 101,85 104.6,85 104.59,84.99 SG1.+
BUTTON  (via drill 0.61)
  Top 0.203: 84.2,70.54 83.83,70.24 U$6.32
  Top 0.305: v84.2,71.4 84.2,70.54 | v99.1,71.4 v99.1,65.4 v99.1,65.39 99.09,65.39
  Top 0.406: 87.73,19.98 87.73,20 | 87.73,19.98 IC2.6 | R25.2 87.73,17.68 87.73,19.98 | v86.11,49 86.12,49.01 | v86.11,49 v86.1,49 | v79.69,40.38 79.69,42.58 v86.11,49
  Top 0.61: 74.54,23.88 X1.2 X1.1 74.58,21.32 75.58,20.32 75.58,16.15 | 75.58,16.15 75.56,16.15 C31.2 | R25.2 86.2,16.17 86.2,16.15 75.58,16.15
  Bottom 0.305: v86.1,49 90.09,49 100.09,59 100.09,64.38 99.1,65.38 v99.1,65.4 | v99.1,71.4 98.81,71.11 84.49,71.11 v84.2,71.4
  Bottom 0.406: X1.2 73.37,23.86 | v79.69,40.38 79.72,40.38 79.73,40.37 79.69,40.32
  Bottom 0.61: 73.37,23.86 71.81,25.43 71.81,29.23 79.69,37.12 79.69,40.32
CD  (via drill 0.61)
  Top 0.203: v81.8,79.3 81.8,80.3 82.34,80.8 82.34,80.9 U$6.52
  Bottom 0.305: RN1.2 56.88,78.57 58.91,80.61 72.16,80.61 72.77,80.01 81.17,80.01 81.81,79.37 81.8,79.36 v81.8,79.3
  Bottom 0.406: 55.13,78.59 55.19,78.65 | 55.13,78.59 RN1.2 | SV2.3 55.03,78.49 55.13,78.59
CE  (via drill 0.61)
  Top 0.203: 80.84,80.26 80.84,80.9 U$6.55
  Top 0.305: v87.7,82.6 88.5,83.4 88.5,95.99 87.68,96.81 85.94,96.81 85.93,96.8 v85.9,96.8 | v82.5,77.4 81.76,77.4 80.83,78.32 80.83,79 80.84,79 80.84,80.26
  Top 0.406: SV2.16 | SV2.16 | RN2.7 45.12,93.78 SV2.16
  Bottom 0.305: v87.7,82.6 v82.5,77.4
  Bottom 0.406: SV2.16 46.51,95.06 83.2,95.06 84.94,96.8 v85.9,96.8
CTR_90_45  (via drill 0.61)
  Top 0.203: 85.1,77.75 85.5,77.75 U$6.45
  Top 0.305: 83.79,97.71 83.79,97.72 | v83.8,97.7 83.79,97.71 | 83.79,97.71 83.79,96.89 85.12,95.56 86.28,95.56 87.43,94.4 87.43,86.31 86.89,85.76 85.1,83.96 84.42,83.29 84.42,78.43 85.1,77.75
  Bottom 0.305: SV5.13 24.93,97.65 24.93,97.64 58.45,97.64 60.19,95.89 82.26,95.89 83.84,97.48 83.84,97.65
  Bottom 0.406: 83.84,97.65 83.84,97.66 v83.8,97.7
CTR_DP_BP  (via drill 0.61)
  Top 0.203: U$6.49 83.84,81.5 83.84,81.61 83.84,82.41 83.83,82.49
  Top 0.305: 83.83,82.47 83.83,82.49 83.83,85.78 84,85.96 84,92.47 83.4,93.08 | 83.4,93.08 83.37,93.1 | v81.58,103.95 81.58,97.16 82.7,96.04 82.7,93.78 83.4,93.08
  Bottom 0.203: SV5.9 23.1,104.8
  Bottom 0.406: 23.1,104.8 23.94,103.96 81.58,103.96 81.6,103.95 | 81.6,103.95 81.63,103.92 | 81.6,103.95 v81.58,103.95
CTR_E_H  (via drill 0.61)
  Top 0.203: 84.83,76.5 85.06,76.25 85.3,76.24 85.5,76.24 U$6.42
  Top 0.305: v84.29,77.11 84.83,76.5
  Bottom 0.305: SV5.11 20.93,101.53 20.93,99.28 23.7,96.51 42.19,96.51 42.74,95.96 42.74,94.21 42.71,94.18 42.72,94.18 42.75,94.18 44.46,92.47 82.31,92.53 83.97,90.88 86.62,90.88 88.88,88.72 88.96,88.56 88.96,82.17 87.2,80.42 86.52,80.42 84.3,78.21 84.3,77.5 | 84.3,77.5 84.3,77.48 | 84.3,77.5 v84.29,77.11
D0  (via drill 0.61)
  Top 0.203: 78.33,80.29 U$6.60
  Top 0.305: 78.33,80.29 78.35,80.28 78.35,76.82 79.21,75.95 v79.21,74.94 | v79.21,74.94 v79.21,74.93 | v79.21,74.94
  Top 0.406: SV2.8 45.18,83.55 | SV2.8 | RN2.3 45.11,83.62 SV2.8
  Bottom 0.203: 44.1,75.44 44.1,75.4
  Bottom 0.305: 44.08,74.75 44.08,75.44 44.1,75.44 44.1,79.35 44.44,79.69 45.55,79.69 46.47,80.61 46.47,82.25 45.17,83.55 SV2.8 | 44.08,74.75 | 44.08,74.75 | 44.08,74.75 46.65,72.18 50.41,72.18 51.78,73.53 71.65,73.53 73.88,71.18 76.61,71.18 79.22,73.8 79.22,74.95 | 44.08,74.75 | 79.22,74.95 79.22,74.96 | 79.22,74.95 v79.21,74.94
D1  (via drill 0.61)
  Top 0.203: v77.84,82.4 77.84,81.5 U$6.61
  Bottom 0.305: 55.54,83.24 75.22,83.24 76.08,82.39 77.82,82.39
  Bottom 0.406: SV2.7 48.64,82.64 52.32,82.64 53.31,83.62 55.16,83.62 55.16,83.63 RN1.4 55.54,83.24 | 77.82,82.39 v77.84,82.4
D2  (via drill 0.61)
  Top 0.203: U$6.62 77.33,80.9 77.33,80.8 77.33,79.9 77.34,79.88
  Top 0.254: 77.69,79.53 77.34,79.88
  Top 0.305: 77.69,79.53 77.68,75.38 77.34,75.04 v77.34,74.95 | v77.34,74.95 v77.34,74.94 | v77.33,74.95 v77.34,74.95
  Top 0.406: v48.8,84.5 49.05,84.25 49.05,74.05 49.77,73.34 49.8,73.34 v49.8,73.3 | SV2.10 45.11,86.16 RN2.4
  Bottom 0.305: v49.8,73.3 50.74,74.24 71.99,74.24 74.11,72.12 76.28,72.12 77.34,73.18 77.34,73.91 | 77.34,73.91 77.34,73.97 | 77.34,73.91 v77.33,74.95
  Bottom 0.406: SV2.10 46.46,84.82 48.48,84.82 v48.8,84.49 | v48.8,84.49 48.82,84.47 | v48.8,84.5 v48.8,84.49
D3  (via drill 0.61)
  Top 0.203: 76.83,81.92 U$6.63
  Top 0.305: 76.83,81.93 76.83,81.92 | v76.83,84.28 76.83,81.93 | 76.83,81.93 76.84,81.93
  Bottom 0.305: RN1.5 56.4,85.9 57.7,84.6 76.3,84.6 76.42,84.55 v76.83,84.28
  Bottom 0.406: SV2.9 48.4,86.1 53.9,86.1 RN1.5
D4  (via drill 0.61)
  Top 0.203: U$6.64 76.34,80.91 76.34,78.51 v76.71,78.15
  Top 0.305: v70.39,79 64.3,79 v64.3,78.5 | SV2.12
  Top 0.406: v46.7,77.4 46.46,77.64 46.46,87.93 45.74,88.65 SV2.12
  Bottom 0.305: v64.3,78.5 58.4,78.5 57.3,77.4 v46.7,77.4 | v76.71,78.15 v76.71,78.16 75.87,79 v70.39,79
  Bottom 0.406: SV2.12 45.19,88.65 45.13,88.7 RN2.5
D5  (via drill 0.61)
  Top 0.203: U$6.1 74,79.25 73.61,79.25
  Top 0.254: 73.62,81.59 73.61,79.25
  Top 0.305: v57.17,82.21 57.17,82.02 57.17,87.32 56,88.1 RN1.6 | v74,81.98 73.62,81.59
  Bottom 0.305: v74,81.98 73.67,82.21 v57.17,82.21
  Bottom 0.406: SV2.11 48.4,88.7 53.9,88.7 RN1.6
D6  (via drill 0.61)
  Top 0.203: 75.58,78.74 74.6,78.74 U$6.2
  Top 0.254: v75.85,89.3 75.85,79.05 75.58,78.74
  Bottom 0.305: SV2.14 46.37,89.99 71.71,89.99 72,90.28 73.34,90.28 74.39,89.23 75.92,89.23 75.92,89.28 v75.85,89.3
  Bottom 0.406: SV2.14 45.19,91.2 45.15,91.24 RN2.6
D7  (via drill 0.61)
  Top 0.203: 73.42,78.24 73.46,78.24 74,78.24 U$6.3
  Top 0.254: 72.9,85.27 72.91,78.55 73.21,78.25 73.46,78.25 73.46,78.24
  Top 0.305: 72.9,85.27 74.89,87.28 v74.91,90.13
  Bottom 0.305: v74.91,90.13 73.64,91.28 56.04,91.28 RN1.7
  Bottom 0.406: SV2.13 48.4,91.2 53.9,91.2 RN1.7
D+  (via drill 0.61)
  Top 0.203: U$6.37 86.67,73.75
  Top 0.254: 89.96,73.74 89.95,73.74 89.93,73.76 86.67,73.75
  Top 0.305: 89.96,73.74 v95.2,68.5
  Bottom 0.305: v95.2,68.5 115.34,68.5 116.34,67.5 116.34,60.93 117.34,59.93 120.52,59.93 121.52,58.93 121.52,56.34 121.53,56.33 121.53,51.47 121.99,51.01 123.51,51.01 124.76,49.76 124.75,49.76 X2.3
D-  (via drill 0.61)
  Top 0.203: U$6.36 86.67,73.25
  Top 0.254: 86.67,73.25 86.86,73.25 89.09,71.02 90.48,71.02 91.41,70.09 91.41,69.04 91.38,69 v91.4,69
  Bottom 0.305: v91.4,69 93.05,67.35 114.45,67.35 115.45,66.35 115.45,59.87 116.45,58.87 119.57,58.87 120.57,57.87 120.57,55.74 | 120.57,55.74 | 120.57,55.74 120.57,50.58 121.41,49.74 122.71,49.74 122.72,49.73 122.73,49.73 X2.2
DS1306_E  (via drill 0.61)
  Top 0.203: 70.12,92 70.12,92.1 | 86.5,78.75 U$6.47 | 70.68,93.42 v70.7,93.4
  Top 0.305: v87.1,79.1 87.1,78.75 86.5,78.75 | U$8.12 70.12,92 | 70.72,93.45 70.74,93.47 | 70.72,93.45 70.69,93.45 | 70.12,92.1 70.12,92.86 70.68,93.42 70.72,93.45
  Bottom 0.203: v70.7,93.4 70.74,93.47
  Bottom 0.305: v87.1,79.1 90.7,82.7 90.72,89.3 87.02,92.78 86.56,93.2 83.1,93.18 83.08,93.18 83.06,93.15 82.74,93.47 70.74,93.47
FAZ  (via drill 0.61)
  Top 0.203: 73.32,72.25 74,72.25 U$6.15
  Top 0.305: v72.98,70.71 72.98,71.91 73.32,72.25 | v58.84,71.12 59.3,71.7 59.3,102.4 v50.4,111.31
  Top 0.406: v38.95,119.66 v38.95,119.67 38.96,119.67 39.48,119.15 41.87,119.15
  Top 0.61: 41.87,119.15 U$7.3
  Bottom 0.305: v58.84,71.12 59.45,70.75 69.39,70.75 69.93,70.21 72.4,70.21 73.03,70.84 73.03,71.13 | 72.99,71.11 72.99,71.1 v72.98,70.71 73.03,71.13 | 73.03,71.13 73.03,71.14
  Bottom 0.406: v50.4,111.31 50.4,111.28 50.4,111.27 50.4,114.33 45.58,119.15 45.58,119.14 | 45.58,119.14 | v38.95,119.66 45.06,119.66 45.58,119.14
FAZ_0
  Top 0.61: SV5.4 37.22,112.8 38.37,113.95 38.37,116.78 39.48,117.9 41.81,117.9 41.83,117.89 U$7.2
FAZ_1
  Top 0.61: U$7.1 41.78,116.61 41.78,112.26 39.78,110.26 SV5.6
GND  (via drill 0.61)
  Top 0.203: C16.2 94.1,53.8 | 96.8,53.8 IC3.4 97.1,55.8 | 73.42,75.25 U$6.9 74.61,75.25 75.13,75.26 75.77,75.25 | C1.2 70.3,75.25 | 77.5,70.51 77.83,70.21 77.83,70 U$6.20 | 80.34,70.48 U$6.25 80.33,69.39 80.33,68.79 | 81.47,75.75 U$6.41 86.1,75.75 86.64,75.75 87.03,75.76 | 80.5,66.9 C14.2 | 97.1,58.7 C6.- | C7.2 122,63.4 | 32.8,63.1 U$11.6 | C4.2 43.1,69.4 | C10.- 80.8,91.1 80.64,91.31 | 44.8,108.33 44.8,108.2 | U$10.1 80.4,36.3 80.4,35 80.39,34.23 | v57.91,75.96 58,76 57.95,75.95 | v65.01,75.94 65.1,76 65.1,75.94 | v65.17,57.98 65.2,58 65.21,57.99 | 65.21,54.5 65.3,54.5 | 66,75.94 66,76 C29.- | C19.2 65.3,53.7 65.21,53.86 | 65.23,49.35 65.3,49.4 C11.- | C18.- 67.2,37.6 66.81,37.6 | 73.41,96.08 73.4,96.1 73.4,96.05 | 68.58,100.08 68.5,100.1 | 71.3,99.1 71.26,99.19 | 45.3,130.62 45.3,130.7
  Top 0.254: 80.33,68.79 80.5,68.57 80.5,66.9 | 75.13,75.26 75.5,75.25 75.84,75.25 76.36,74.74 | 76.36,71.97 76.35,71.97 | 82.55,75.82 84.96,75.82
  Top 0.305: 97.43,75.76 97.43,73.83 | 97.42,75.76 C3.1 | 70.3,75.25 73.42,75.25 | C3.1 121.37,77.38 | SV5.3 SV5.1 | SV5.1 22.48,117.9 33.08,117.9 | 37.97,71.72 33.81,71.72 | 40.23,71.7 37.97,71.7 | U$8.10 69.48,99.22 68.43,99.22 | 77.5,70.51 76.36,71.75 76.36,71.97 | 76.36,74.74 76.36,71.97 | 76.36,71.97 79.16,71.97 80.34,70.79 80.34,70.48 | U$8.6 72.08,96.05 73.4,96.05 74.68,96.05 | 74.68,96.05 75.32,96.05 75.62,95.76 78.35,95.76 | U$8.4 73.38,99.49 73.41,99.49 73.41,96.08 73.39,96.06 | U$8.2 74.68,96.05 | 78.35,95.76 78.36,95.76 | C36.1 78.35,95.76 | 72.06,97.62 72.06,98.35 71.3,99.1 70.99,99.42 | 74.66,97.4 74.66,98.7 75.4,99.44
  Top 0.406: IC1.4 105.12,98.14 R1.2 | C7.2 123.7,63.4 126.78,63.4 | 61.09,11.08 61.09,11.14 61.15,11.14 | 69.68,30.76 69.71,30.76 69.71,30.84 | 69.68,26.11 69.5,26.11 69.5,26.15 | 63.94,11.08 63.94,11 | 63.94,13.94 IC4.4 | IC5.4 63.29,43.55 66.79,43.55 66.79,43.53 66.81,43.53 | 80.31,62.4 80.31,59.76 | 80.33,65.84 C28.- | 88.25,59.76 C13.2 | C29.- 69.27,75.73 | 56.53,34.96 56.4,34.96 | 63.36,30.86 | 63.36,30.86 IC15.4 63.4,30.84 64.58,30.84 | 63.36,30.86 62.04,30.86 | 94.1,53.8 96.8,53.8 | 97.1,55.8 97.1,58.7 | 122,63.4 120.2,63.4 R8.1 119.3,63.5 119.2,63.6 119.2,67.87 119.04,68.03 X8.1 118.4,68.03 118.43,68.01 118.42,68 115.6,68 115.37,67.77 C5.1 | R7.2 91.61,118.06 92.81,118.06 94.16,119.41 v94.16,122.31 94.16,122.33 | U$7.5 41.85,121.67 44.8,121.67 44.8,108.33 | U$7.7 41.85,124.21 44.7,124.21 44.7,122.94 41.85,122.94 U$7.6 | IC6.4 115.77,109.18 117.81,109.18 | 117.81,109.18 R26.2 | 121.6,109.18 117.81,109.18 | 65.03,75.94 65.1,75.94 66,75.94 66.87,75.94 | C6.- 92.01,59.77 | 54.95,34.96 C20.-
  Top 0.61: C8.2 112.22,117.77 112.22,119.79 110.1,119.79 U$12.1 | 110.61,28.32 110.61,28.41 | 110.61,28.32 R23.2 | 106.44,28.32 110.61,28.32 | 89.01,19.97 89.01,20 | 89.01,19.97 IC2.7 90.65,19.97 90.65,27.02 89.36,28.3 89.36,34.22 89.36,34.23 | R25.1 89.01,16.17 89.01,19.97 | 64.37,21.59 C9.2 | 63.94,11.08 63.94,13.94 | 65.23,49.35 65.21,49.35 | 62.04,30.86 62.04,34.96 56.53,34.96 54.95,34.96 | 121.6,85.61 121.67,85.61 121.52,85.77 | 22.47,115.35 SV5.1 | SV5.3 | U$7.8 35.74,124.27 41.83,124.27 41.83,124.23 U$7.7 | U$7.8 | 33.09,117.9 33.09,119.16 | 33.09,119.16 33.09,122.96 | 33.09,122.96 33.09,124.24 U$7.8 | U$7.9 33.09,122.96 | U$7.12 33.09,119.16 | 33.08,117.9 33.09,117.9 | U$7.13 35.7,117.9 33.09,117.9 | 32.79,17.11 32.73,17.11 8.05,17.11 8.05,17.19 | H1.B3,2 4.98,9.93 | 8.05,12.99 8.05,17.19 | 8.05,17.19 C37.1 | 40.23,71.7 40.23,71.67 40.26,71.67 | 43.03,71.76 43.02,71.76 | 43.02,71.76 C4.2 | 43.02,71.76 43,71.76 | 41.83,122.96 U$7.6 | 78.34,107.29 C36.1 80.64,95.75 80.64,91.31 | U$7.5 41.85,121.72 41.85,121.73 41.9,121.68 | 121.6,85.67 121.62,85.67 121.62,85.76 | 81.44,90.69 81.44,90.7 C10.- | C15.2 81.44,90.69 | 81.44,90.69 | 94.18,124.87 U$12.18 89.03,124.87 87.71,126.19 | 94.18,122.33 U$12.20 91.08,122.34 88.89,122.34 87.64,121.09 | 81.28,126.19 X6.5 | 8.05,17.19 | C21.- | C21.- | C8.2 117.06,117.76 C21.- | 121.6,119.31 121.57,119.31 121.57,119.32 121.57,119.33 | v63.54,61.88 63.56,61.88 | 65.21,53.86 65.21,54.5 65.21,57.99 | 132.14,52.26 132.14,52.23 X2.4 | 69.68,26.93 69.69,26.93 69.65,26.97 | C11.- 65.67,49.15 65.67,53.66 C19.2 | 69.68,16.24 69.84,16.24 69.84,16.18 C31.1 | 69.68,30.98 69.7,30.98 69.7,31.06 C17.- | 81.01,34.23 C32.1
  Top 0.61: 64.58,30.84 | 57.95,75.95 57.95,72.31 57.53,71.89 57.53,70.64 58.74,69.43 58.74,68 63.54,63.2 v63.54,61.89 v63.53,61.88 | v63.54,61.88 63.49,61.88 | v63.53,61.88 63.5,61.85 | v63.54,61.88 v63.53,61.88 | 43.18,130.62 45.3,130.62 R33.A | BAT2.P$2 54.62,119.88 54.61,119.89 61.91,127.19 C39.-
  Top 0.813: C8.2 | 70.34,34.23 70.34,34.25 70.48,34.25 R11.2 70.36,37.13 70.31,37.08 70.27,37.12 | 73.98,34.23 73.98,34.35 74.04,34.35 C26.1 | 80.39,34.23 80.39,34.2 80.38,34.2 | 78.85,34.23 78.85,34.3 79,34.3 | 84.8,34.23 84.8,34.2 84.88,34.2 R24.2 | 69.68,21.59 64.37,21.59 | 32.68,41 U$11.P16COM | C27.2 55.43,14.22 55.43,11.08 | 81.47,59.76 88.25,59.76 92.05,59.76 | 80.31,59.76 81.47,59.76 | 80.31,62.4 80.33,62.4 C28.- | C14.2 80.28,65.84 80.33,65.84 | 100.58,64.25 100.58,73.81 | 97.43,73.77 97.43,73.83 C2.2 | C3.1 | 97.43,75.76 97.42,75.76 87.03,75.76 | 81.47,59.76 81.47,59.77 | U$13.3 81.47,56.78 81.47,59.76 | 69.42,75.88 69.49,75.95 | 69.42,75.88 C1.2 | 69.27,75.73 69.42,75.88 | 38.01,71.72 37.97,71.72 C35.- 37.97,71.7 | 33.81,71.72 C34.2 33.81,71.7 | 40.23,71.7 43.03,71.7 43.03,71.76 43.03,75.95 SV2.2 | SV2.2 45.19,75.95 | SV2.2 | 32.73,63.99 32.76,64.02 U$11.6 | SV2.2 37.34,75.95 37.34,98.83 | 45.3,98.83 45.3,98.81 SV2.20 | U$11.3 40.26,71.67 | 121.66,98.37 121.6,98.37 105.88,98.37 R1.2 | 121.57,119.32 C21.- | 121.6,102.84 121.47,102.84 121.47,102.87 | 92.01,59.77 92.01,59.83 | 69.65,26.97 C25.- | 65.67,49.15 65.67,46.34 66.81,46.34 66.81,43.53 66.81,37.6 66.81,37.59 | v33.27,58.29 33.25,58.27 32.8,58.72 32.8,63.1 | 68.59,35.1 68.59,37.61 | C22.- 118.2,114.95 121.6,114.95 | 69.71,30.84 64.58,30.84
  Top 1.016: 132.14,52.26 132.14,61.33 126.78,61.33 | 126.78,63.4 126.78,76.66 121.6,76.66 | 121.6,96.98 121.61,96.98 121.61,96.95 | 32.73,40.75 32.68,40.75 32.68,41 | 121.6,77.53 121.52,77.53 121.37,77.38 | 87.71,126.19 81.28,126.19 | 87.64,121.09 X6.3 X6.4 | 69.68,34.23 69.65,34.23 69.65,35.1 68.59,35.1
  Top 1.27: 121.6,118.78 121.6,119.31 121.6,119.33 | 24.51,38.61 32.13,38.61 | 121.6,85.1 121.5,85.1 121.39,84.99 SG1.-
  Top 1.422: Q5.3 106.44,28.32
  Top 1.676: 69.68,34.23 70.34,34.23 | 51.18,4.62 51.18,11.08 | 51.18,4.62 51.19,4.62 | 51.18,4.62 51.18,4.6 | 32.73,40.75 32.73,17.11 32.73,4.62 51.18,4.62
  Top 2.184: 120.08,36.94 120.08,41.48 132.14,41.48 132.14,52.26 | 126.78,63.4 126.78,61.33 | 121.6,76.66 121.6,77.53 121.6,85.1 121.6,85.61 121.6,85.67 121.6,96.98 121.6,98.37 121.6,102.84 121.6,109.18 121.6,114.95 121.6,118.78 | 70.34,34.23 73.98,34.23 78.85,34.23 80.39,34.23 81.01,34.23 84.8,34.23 89.36,34.23 90.1,34.23 90.1,43.52 110.51,43.52 110.51,36.94 | 69.68,34.23 69.68,30.98 69.68,30.76 69.68,26.93 69.68,26.11 69.68,21.59 69.68,16.24 69.68,11.08 63.94,11.08 61.09,11.08 55.43,11.08 51.18,11.08 | 121.6,119.31 121.6,125.35 118.08,125.35 118.08,135.62 94.18,135.62 94.18,124.87 94.18,122.33
  Bottom 0.203: v63.54,61.88 63.6,61.9 v63.54,61.88 | v57.91,75.95 58,76 v57.91,75.96 | 64.6,75.95 64.6,76 v65.01,75.94 | v65.17,57.98 65.2,58
  Bottom 0.406: 65.03,75.95 64.6,75.95 v57.91,75.95 v57.91,75.96
  Bottom 0.61: v63.54,61.88 63.54,59.61 v65.17,57.98 | v65.17,57.98 | v65.17,57.98 v65.18,57.97
  Bottom 0.813: X4.1 106.4,36.87 Q5.3 | BAT2.P$2 62.56,119.88 70.23,112.2 PAD3.1
  Bottom 1.422: 106.4,28.25 Q5.3
  other vias: 94.15,124.83 31.75,76.71 31.62,58.29 34.92,58.29 34.92,57.02 33.27,57.02 31.62,57.02 34.29,76.71 34.29,74.55 31.75,74.55 44.2,102.49 41.91,102.49 39.62,102.49 37.34,102.49 35.05,102.49 32.77,102.49 32.77,101.22 35.05,101.22 37.34,101.22 39.62,101.22 41.91,101.22 44.2,101.22 79.5,102.74 79.5,101.22 79.5,99.69 66.17,102.23 66.17,100.08 36.72,74.57 79.06,106.05 79.06,108.14 79.06,110.24 77.15,110.24
  pour Bottom: 80.64,126.75 87.38,126.75 89.03,125.09 92.46,125.09 93.22,125.86 95.25,125.86 95.25,121.79 95.25,121.28 93.34,121.28 92.58,122.05 88.9,122.05 87.63,120.78 87.38,120.52 80.64,120.52
  pour Top: 80.37,70.85 80.37,72.31 81.53,73.48 81.53,73.84 76.4,73.84 76.4,71.77 77.24,70.93 77.24,71.26 77.93,71.95 79.29,71.95 80.24,70.85
  pour Top: 31.5,71.63 30.73,71.63 30.73,108.2 44.96,108.2 44.96,98.81 37.64,98.76 37.64,71.58
  pour Top: 52.7,27.81 52.7,1.27 1.27,1.27 1.27,17.14 31.11,17.14 31.14,59.53 36.09,59.53 36.07,27.81
  pour Top: 45.47,108.33 45.47,132.21 24.38,132.21 24.38,123.06 19.43,123.06 19.43,111.76 23.62,111.76 23.62,117.98 33.53,117.98 33.53,125.35 44.2,125.35 44.2,108.33
  pour Top: 109.47,38.1 121.16,38.1 121.16,34.54 109.47,34.54
  pour Top: 96.77,77.85 126.49,77.85 127.76,76.58 127.76,75.44 100.97,75.44 100.97,73.28 96.77,73.28
  pour Top: 122.56,78.11 122.56,126.36 120.02,126.36 120.02,137.79 93.34,137.79 93.34,129.54 105.41,129.54 105.41,133.99 116.84,133.99 116.84,124.46 120.02,124.46 120.02,78.11
  pour Top: 45.47,108.46 45.47,98.55 44.2,98.55 44.2,108.46
  pour Top: 124.59,77.03 127.25,77.03 128.58,75.79 128.52,61.79 133.71,61.79 133.73,40.13 121.16,40.13 121.16,37.85 118.62,37.85 118.62,42.93 130.3,42.93 130.3,59.44 124.59,59.44
  pour Top: 52.83,9.4 70.99,9.4 70.99,33.02 91.19,33.02 91.19,42.29 109.47,42.29 109.47,38.1 111.51,38.1 111.51,44.83 88.9,44.83 88.9,35.56 68.2,35.56 68.2,12.45 52.83,12.45
  pour Bottom: 35.69,58.8 21.72,58.8 21.72,73.66 39.33,73.61 35.6,77.55 19.18,77.6 19.18,56.52 35.69,56.52
  pour Bottom: 30.86,100.84 58.17,100.84 58.17,99.44 80.21,99.47 80.26,103.14 80.14,103.12 30.86,103.12
  pour Top: 77.03,99.31 77.03,105.35 75.69,105.35 75.69,111.19 80.2,111.19 80.26,108.2 80.26,99.31
  pour Top: 65.28,103.12 75.44,103.12 75.44,99.19 65.28,99.19
  pour Top: 80.14,73.41 82.93,73.41 82.93,76.2 80.14,76.2
  pour Top: 91.44,59.82 91.44,64.39 100.84,64.39 100.84,63.25 92.71,63.25 92.71,59.82
  pour Bottom: 65.41,105.41 80.01,105.41 80.01,111.12 65.41,111.12
  pour Top: 73.79,103 73.79,111.12 65.28,111.12 65.28,103
  pour Top: 75.31,99.19 80.14,99.19 80.14,111.12 73.41,111.12 73.41,101.98 75.31,101.98
  pour Top: 38.86,72.39 38.86,75.69 37.34,75.69 37.34,72.39
  pour Top: 43.05,71.63 37.85,71.63 37.85,75.95 43.05,75.95
GPS_ON  (via drill 0.61)
  Top 0.203: v82.27,82.57 81.83,82.03 81.83,81.48 U$6.53
  Top 0.305: v84.36,94.35 v84.36,94.36 84.36,94.36 84.8,93.92 v84.8,85.2 | v114.44,107.81 v114.45,107.81 114.45,111.05 IC6.6
  Top 0.406: IC6.6 115.77,111.91 117.81,111.91 R26.1
  Bottom 0.305: v82.27,82.57 82.98,82.6 84.8,84.42 84.8,85.19 84.82,85.2 84.81,85.2 v84.8,85.2 | v84.36,94.35 85.65,95.64 86.34,95.64 95.95,105.26 107.59,105.26 110.46,108.12 114.15,108.12 114.46,107.82 v114.45,107.81 v114.44,107.81
GPS_POWER  (via drill 0.61)
  Top 0.203: 100.3,116 R6.1 | 102.1,116 R5.1 | 113.17,115.3 113.2,115.3 113.2,115.65
  Top 0.406: IC6.1 113.17,115.3 113.17,115.86
  Top 0.61: U$12.2 | C8.1 114.14,121.06 U$12.2 | U$12.2 110.15,121.07 | U$12.2 | R4.1 106.67,121.07 U$12.2 | R3.1 98.34,106.31 101.31,106.31 IC1.8 101.3,108.33 v101.27,108.33 | 101.26,116 100.3,116 | 101.26,116 102.1,116 | v101.27,111.29 101.26,111.29 101.26,116
  Top 0.813: R5.1 | R5.1 | R5.1 106.67,115.96 R4.1 106.67,115.65 | 106.67,115.65 106.64,115.8 | C22.+ 115.2,115.65 113.2,115.65 106.67,115.65
  Bottom 0.61: v101.28,111.29 101.28,111.3 | v101.28,111.29 v101.27,111.29 | v101.27,108.33 v101.28,108.33 v101.28,111.29
MCLR  (via drill 0.61)
  Top 0.203: 75.16,76.25 U$6.7
  Top 0.305: v90.4,60.9 89.91,61.39 89.91,65.75 93.89,65.75 93.89,68.62 90.68,71.83 89.78,71.83 v88.8,72.8 | v76.52,76.24 76.55,76.24 76.55,76.25 75.16,76.25
  Top 0.406: R9.1 86.87,56.4 U$13.1
  Top 0.813: 86.46,56.81 U$13.1
  Bottom 0.305: U$13.1 88.53,56.78 90.4,58.64 90.4,60.86 v90.4,60.9 | v88.8,72.8 88.5,73.09 82.57,73.09 79.39,76.28 76.48,76.28 | 76.48,76.28 76.44,76.28 | 76.48,76.28 v76.52,76.24
MD2
  Bottom 0.406: RN1.9 53.9,96.4 48.4,96.4 SV2.17
N$1
  Top 0.813: D2.A 116.5,24 116.5,22.9 D1.A 117.5,22.1 123.2,22.1 J1.1
N$2
  Top 0.406: R22.2 101.35,24.09 101.35,18.83 102.6,18.83 102.6,18.82 R19.2
  Top 0.61: 110.89,26.04 110.89,26 110.89,24.14 C24.1 | 107.77,26.02 107.77,26 R22.2 | 114.5,8.5 114.54,8.46 114.58,8.5 C23.- | IC11.1 103.21,18.27 R19.2 | R18.1 C23.- | C23.- 114.61,8.54
  Top 0.813: Q5.2 104.11,26 107.77,26 110.89,26 113.65,26 113.65,26.92 122.87,26.92 124.87,24.92 128.46,24.92 130.16,23.22 130.16,22.04 | IC10.GND 118.21,10.73 114.62,10.73 114.62,8.57 114.6,8.57 | 114.6,8.57 114.55,8.57 | C23.- 114.6,8.57
  Top 1.016: J1.3 130.16,22.04
  Bottom 0.813: J1.3 129.3,20.5 122.8,14 118.8,14 IC10.GND
N$3
  Top 0.813: 97,5.07 97,18.33 | 97,18.33 Q3.3 | 97,18.33 R16.2
  Top 1.016: R15.2 97.52,5.07 | R15.2 | R15.2 97,5.07 97,4.97 | 91.98,4.97 92.1,4.97 IC9.1 | 97,18.33 97.02,18.33 | R16.2
  Top 1.27: 92.1,4.97 97,4.97
  Top 1.676: 97.42,5.12 97.42,5.08 R15.2
N$4
  Bottom 1.27: IC9.2 92.1,7.61 107.65,7.61 107.65,5.02 107.66,5.02 R15.1
N$5
  Top 0.813: D1.C 115.5,17.1 115,16.6 115,14 116,13 IC10.IN
  Bottom 1.27: 116.32,12.42 116.32,12.39 IC10.IN | IC10.IN 116.31,12.42 | IC9.3 116.31,10.2 IC10.IN
N$6
  Bottom 0.203: 53.9,98.9 RN1.10 | SV2.19 48.4,98.9
  Bottom 0.406: 48.4,98.9 53.9,98.9
N$7
  Top 0.61: C23.+ 118.73,8.5 120.02,9.79 120.02,14.23 119.25,15 | IC10.OUT 116.32,14.93 116.34,14.91 116.43,15 119.25,15 | IC11.6 112.5,15.72 114.45,17.67 114.45,19.18 115.18,19.92 118.6,19.92 119.24,19.28 119.24,16.55 | 119.25,15 119.25,15.02 119.22,15.06 119.24,15.08 119.24,16.55 | R17.2 132.85,25.9 132.85,17.72 131.68,16.55 119.24,16.55
N$8
  Top 0.61: X3.2 124.8,36.3 123,34.5 123,32.75 126,29.75 126.09,29.84 R17.1
N$9  (via drill 0.61)
  Top 0.406: v108.9,18.48 109.8,18.5 IC11.8
  Top 0.61: 92.49,28.27 | 92.49,28.27 Q3.1 | 92.49,28.27 92.43,28.21 R16.1 | R16.1 | R16.1 92.5,18.34
  Bottom 0.61: 108.8,18.48 108.8,18.5 v108.9,18.48 | 108.8,18.48 110,18.48 125.26,33.75 X3.1 | 92.38,28.28 92.39,28.27 Q3.1 92.41,28.27 92.39,28.25 92.44,28.2 92.44,26.45 100.41,18.48 108.8,18.48
N$10  (via drill 0.61)
  Top 0.203: v108.23,100.41 108.3,100.4 v108.23,100.4
  Top 0.305: IC1.2 102.59,101.06 102.59,97.81
  Top 0.406: R2.2 | 108.23,100.36 v108.23,100.4 v108.23,100.41 | IC1.2 102.56,101.07 102.56,97.9 R1.1
  Top 0.61: 108.91,103.45 R2.2 | v108.23,100.41 R2.2 | 102.59,97.81 102.59,95.71 108.35,95.71 108.35,96.38 v108.33,96.38 v108.33,96.39
  Bottom 0.203: v108.23,100.41 108.3,100.4 108.2,100.4
  Bottom 0.406: 108.2,100.4 108.2,100.48 108.23,100.48
  Bottom 0.61: v108.23,100.41 v108.24,100.4
  Bottom 0.813: v108.31,96.38 108.31,96.35 | v108.33,96.39 v108.31,96.38 | 108.2,100.48 108.31,100.36 v108.31,96.38
N$11
  Top 0.61: 103.05,109.83 103.85,109.83 IC1.6 103.87,106.27 103.87,101.06 IC1.3 | 96.39,109.83 103.05,109.83 | 96.39,109.83 96.25,109.83 96.13,109.83 91.88,109.83 91.87,109.82 90.6,109.82 90.6,109.78 Q2.E | R5.2 103.05,113.16 103.05,109.83 | Q1.B 96.39,112.77 96.39,109.83
N$12  (via drill 0.61)
  Top 0.203: 79.33,80.17 79.33,80.92 U$6.58
  Top 0.305: 79.33,80.27 79.33,80.14 79.33,80.15 | 79.33,80.15 v79.33,79.02 | 79.33,80.15 79.33,80.17
  Top 0.406: v108.2,74.3 109.3,74.3 109.77,73.83 109.77,70.73 109.92,70.58 R12.1 113.28,70.58 | 113.28,70.58 113.27,70.57 C5.2 118.34,70.57 118.36,70.55 X8.2 | 113.28,70.58 113.3,70.6
  Bottom 0.305: v108.2,74.3 108.23,74.3 107.89,74.64 91.19,74.64 90.85,74.3 90.86,74.29 88.32,74.29 87.74,73.72 83.48,73.72 79.33,77.87 79.33,79.05 v79.33,79.02
N$13
  Top 0.406: R2.1 108.88,106.31 108.88,106.27 | 106.71,113.17 R4.2
  Top 0.61: IC1.5 106.71,106.27 | 106.71,106.27 108.88,106.27 | 106.71,106.27 106.71,113.17
N$15
  Top 0.61: C24.2 113.21,18.96 113.21,17.99 112.21,16.99 110.98,16.99 110.96,16.97 110.94,17 IC11.7
N$16
  Top 0.61: IC11.5 110.86,14.46 110.86,11.31 R18.2
N$17
  Top 0.406: R6.2 99.32,113.12 99.32,113.09
  Top 0.61: Q1.E 97.64,114.67 97.64,113.12 99.33,113.12 | 99.33,113.12 R6.2 | 99.33,113.12 99.33,113.14
N$18
  Top 0.305: Q2.B 88.75,110.84 91.61,110.84 R7.1 | R7.1 | R7.1 91.57,113.72
  Top 0.406: Q1.C 93.91,113.7 91.63,113.7 R7.1
N$19
  Top 0.61: IC2.11 85.24,26.1 | IC2.11 85.21,26.13 86.48,26.13 | IC2.12 IC2.11 | 86.48,26.13 86.52,26.13 | 86.48,26.13 IC2.10
N$20
  Top 0.203: 80.34,85.1 80.33,82.33 80.33,81.52 U$6.56
  Top 0.305: 80.33,82.33 80.33,86.62 C10.+
N$21
  Top 0.305: U$8.3 | U$8.3 74.01,97.41 74.01,99.27 Q7.2 | 74.42,99.95 | Q7.2 74.42,99.95 | 74.42,99.95 74.42,99.97 | 74.4,99.91 Q7.2 | Q7.2 74.42,99.95 | C38.1 75.5,101.03 74.42,99.95
N$22
  Top 0.61: 99.89,18.82 99.89,18.83 | 99.89,18.82 R19.1 | R20.2 99.89,16.97 | 99.89,16.97 99.89,18.82 | 99.89,16.97 99.94,16.97 99.94,17 IC11.2
N$23  (via drill 0.61)
  Top 0.305: U$8.1 75.33,98.09 75.55,98.3 76.48,98.3 v76.48,98.32
  Top 0.61: BAT2.P$1 76.11,121.33 C39.+
  Bottom 0.305: 74.66,119.94 BAT2.P$1
  Bottom 0.406: v76.48,98.32 81.31,98.32 83.58,100.58 83.58,110.52 81.24,112.86 77.85,112.86 74.66,116.06 74.66,119.94
N$24
  pour Top: 72.39,13.97 89.53,13.97 89.53,1.27 72.39,1.27
N$25
  Top 0.305: U$8.5 72.75,97.41 72.75,99.22 Q7.1 | 71.88,99.95 | Q7.1 71.88,99.95 | 71.88,99.95 71.88,99.97 Q7.1
N$26
  Top 0.305: R13.2 67.34,96.08 70.29,96.08 70.8,96.58 70.8,97.36 U$8.8
N$27
  Top 0.813: D2.C 116.4,31.12 R23.1 | R23.1 101.84,31.12 101.84,28.32
  Top 1.016: R23.1 | Q5.1 101.84,28.32
N$28
  Top 0.305: 71.41,97.37 U$8.7 | R14.2 69.07,95.31 70.48,95.31 71.44,96.27 U$8.7 | U$8.7 71.44,97.41
N$29
  Top 0.61: IC2.4 85.21,19.93 83.94,19.93 IC2.3
N$30
  Top 0.61: IC2.13 IC2.2 82.67,19.96 82.72,19.96
N$31  (via drill 1)
  other vias: 97.79,85.09
N$32  (via drill 0.61)
  Top 0.406: 83.83,37.04 | v83.81,37.03 83.83,37.04 | U$10.2 82.39,37.04 83.83,37.04
  Top 0.61: IC2.14 81.4,26.4 77.17,26.36 | X1.3 77.17,26.36 | 77.17,26.36 79.13,26.4 | C17.+ 77.17,31.03 77.17,26.36
  Bottom 0.305: 86.67,45.45 86.68,45.43 | v83.81,37.03
  Bottom 0.406: 86.68,45.43 120.03,45.4 122.78,42.65 131.19,42.69 133.21,44.7 133.21,57.6 127.86,62.95 127.86,76.04 127.86,76.05 | 86.67,45.45 86.36,45.45 85.47,44.55 85.47,37.8 84.69,37.03 v83.81,37.03 | 127.86,76.05 127.87,76.05 | S1.1 131.51,80.75 131.5,80.75 130.84,81.41 127.53,81.41 126.94,80.82 126.94,77.98 127.86,77.05 127.86,76.05
  Bottom 0.61: X1.3 74.54,29.08 82.48,37.01 83.81,37.01 v83.81,37.02 v83.81,37.03
N$33  (via drill 0.61)
  Top 0.203: 63.9,32.73 IC15.6 | 81.39,18.55 IC2.1
  Top 0.406: IC2.5 86.48,18.09 81.41,18.09 81.41,20 81.4,20 | 81.4,20 81.36,20 | IC2.1 81.4,20 | v65.44,18.55 65.44,15.9 IC4.6 | v65.37,32.73 63.9,32.73 | v78.19,18.55 81.39,18.55 | IC15.6 65.4,32.74 65.4,34.07 63.25,36.22 63.25,40.69 62.01,41.93 62.01,45.48 62.02,45.47 63.28,45.47 IC5.6
  Bottom 0.203: v65.44,18.55 65.42,18.53
  Bottom 0.406: v65.44,18.55 65.36,31.87 v65.37,32.73 | 65.42,18.53 v78.19,18.55
N$36  (via drill 1)
  other vias: 105.41,49.53
N$37
  Top 0.61: U$12.3 C21.+
N$38
  Top 0.61: U$12.19 90.1,123.6 84.6,123.6 X6.1
N$39  (via drill 1)
  other vias: 105.41,52.07
N$40
  Top 0.61: 102.64,14.96 102.64,14.92 | R20.1 102.64,14.96 | IC11.3 102.64,15.72 102.64,14.96
N$41
  Top 0.61: R21.2 105.16,22.23 105.16,21.3 107.75,21.3 107.75,21.29 | 107.75,21.29 107.75,21.27 | 107.75,21.29 R22.1 107.78,14.45 105.68,14.45 | 105.68,14.45 105.67,14.45 | IC11.4 105.68,14.45
N$42
  Top 0.813: R21.1 99.47,22.7 99.47,30.93 94.77,30.93 94.77,28.27 Q3.2
  Bottom 0.406: 115.82,43.14 X4.2
  Bottom 0.813: 94.72,43.18 94.1,43.2
  Bottom 1.422: 94.74,43.14 94.74,43.2 94.72,43.18
  Bottom 1.676: 94.74,43.14 94.83,43.14 | 94.83,43.14 115.82,43.14 | Q3.2 94.72,43.18 | 94.83,43.14 94.83,43.18 | 94.83,43.18 94.83,43.19 | 86.81,43.18 X5.1 | 94.83,43.18 86.81,43.18 | 86.81,43.18 86.81,43.22
  pour Bottom: 112.78,43.81 117.98,43.81 117.98,39.24 112.78,39.24
N$43  (via drill 1)
  other vias: 105.41,54.61
N$44  (via drill 1)
  other vias: 105.41,57.15
N$45  (via drill 1)